# Altium schematic sheet FMC_Connector.SchDoc
size 594 x 419 mm; SheetNumber: 2; Title2: FMC Connector; ModifiedDate: -
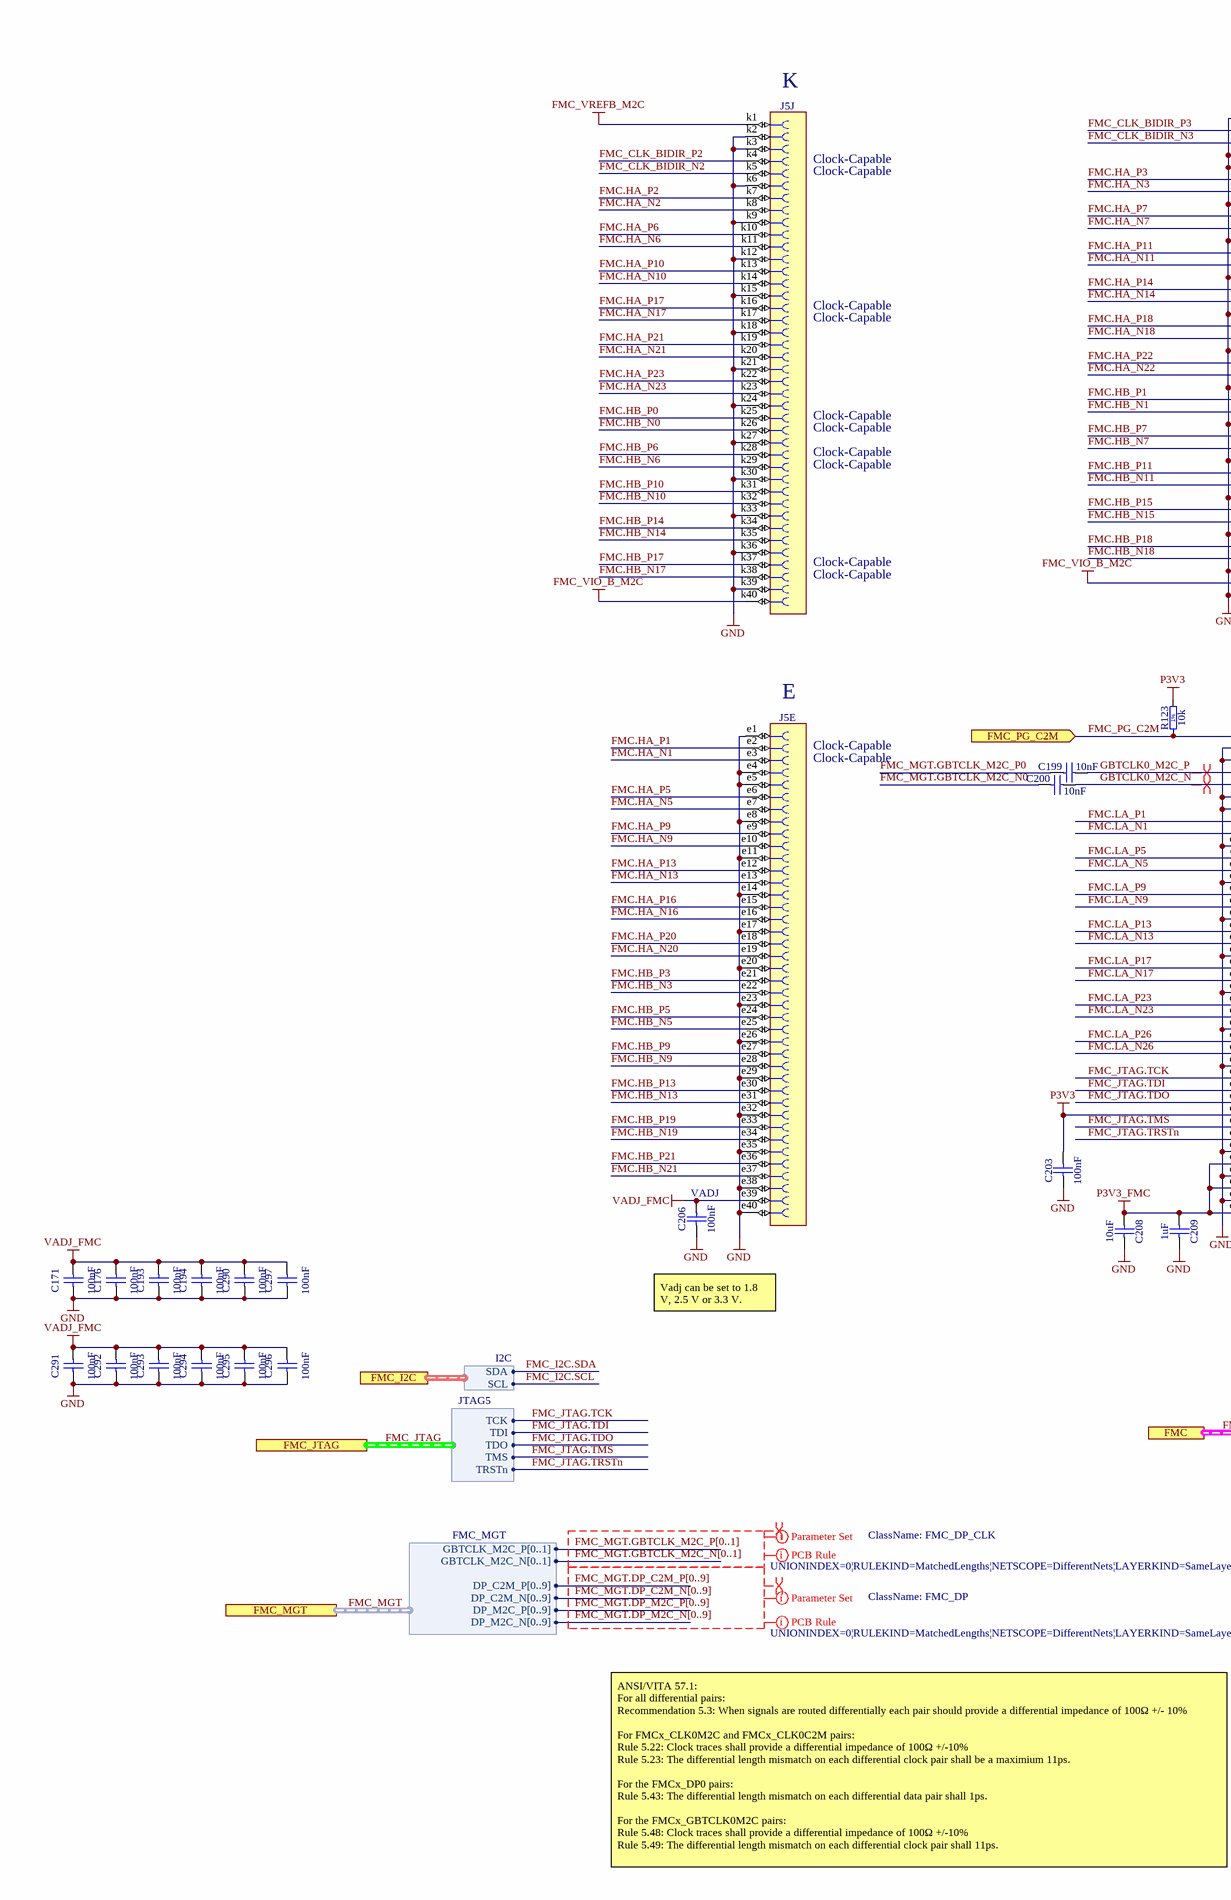
[diagram p0: FMC_Connector.SchDoc, left]
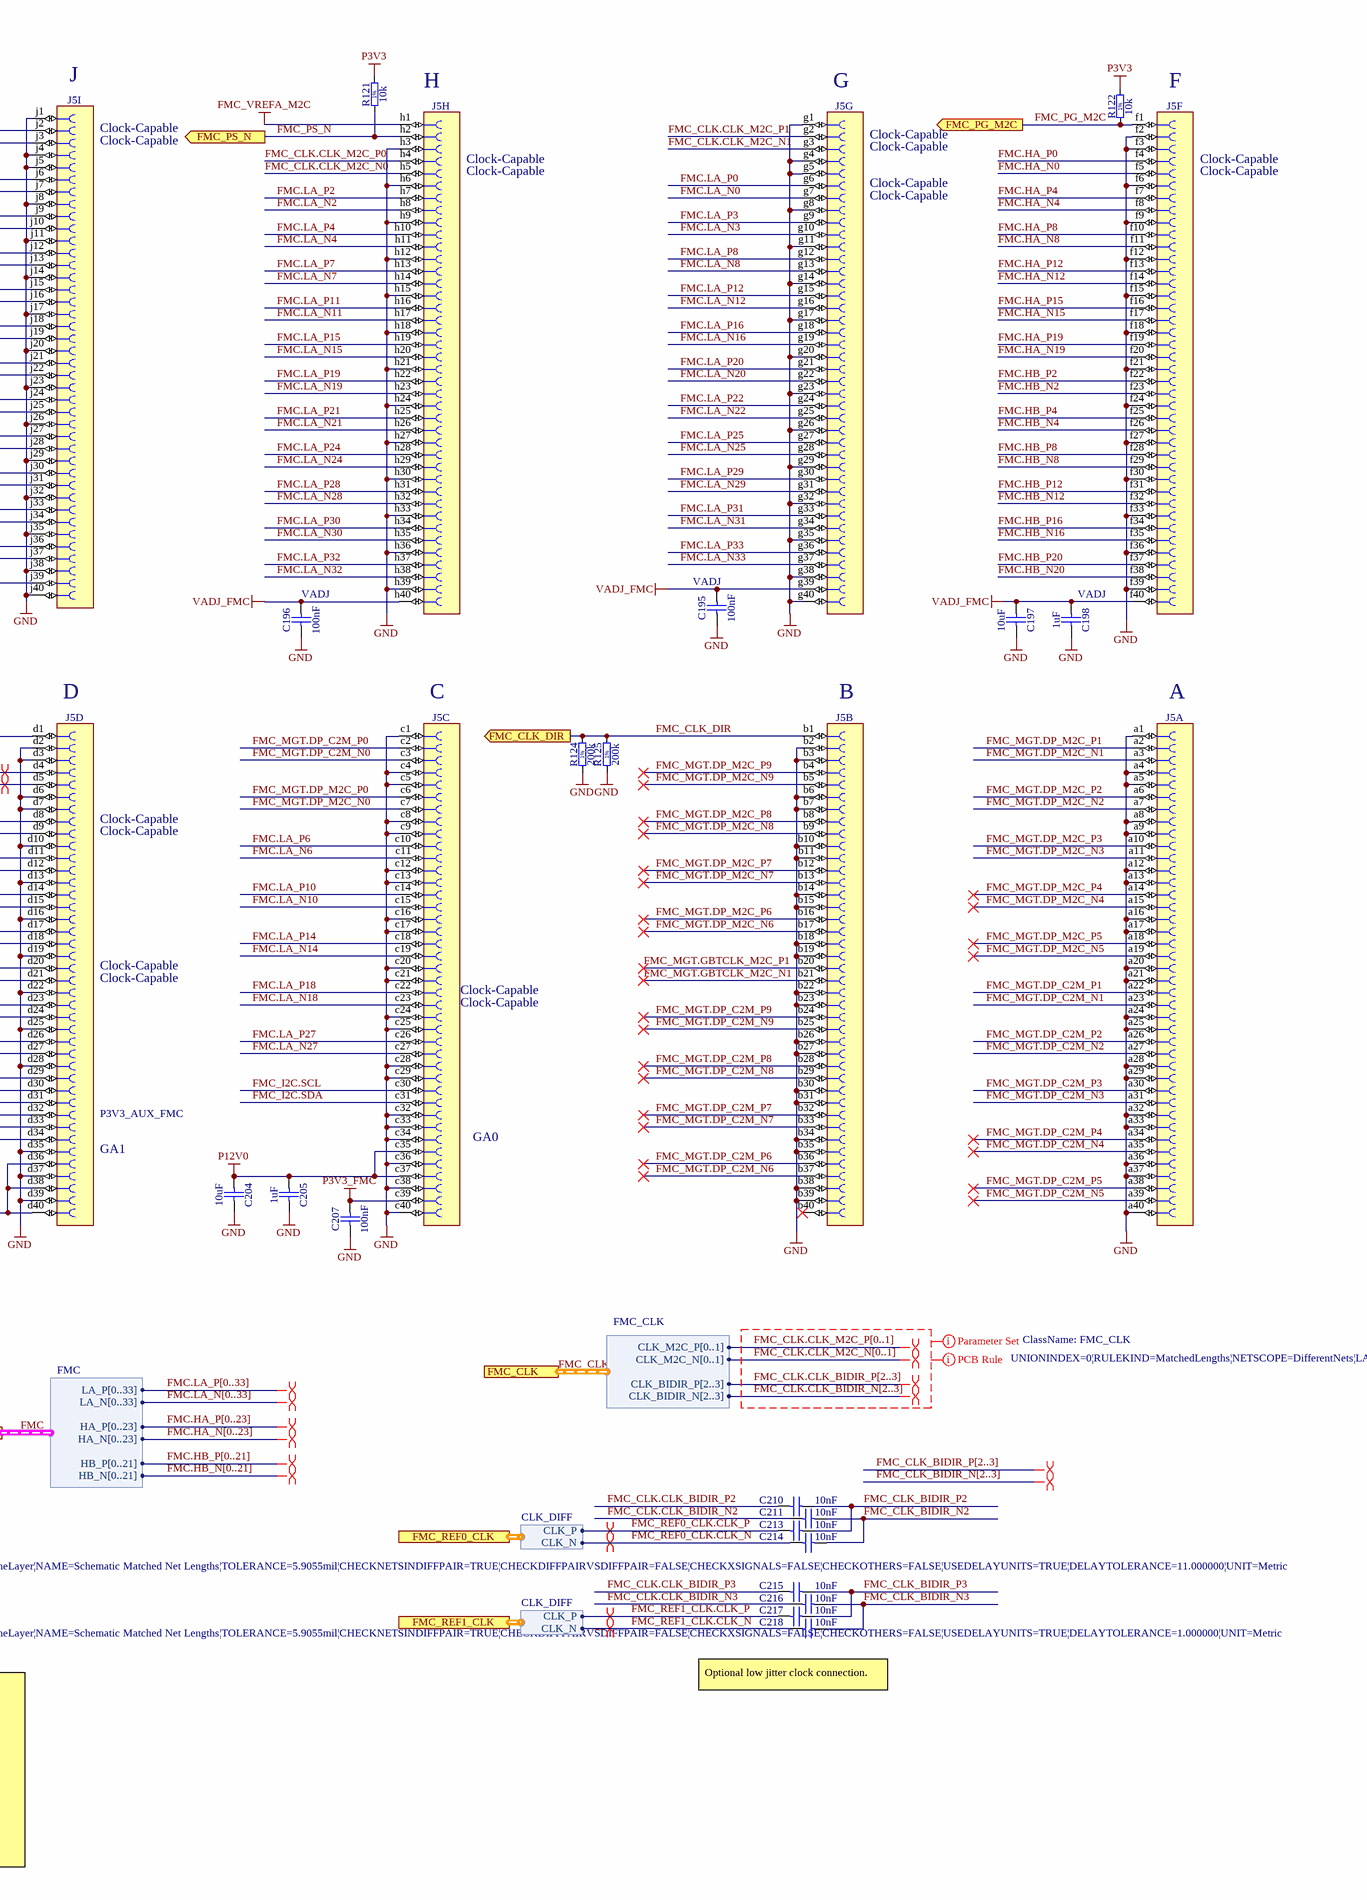
[diagram p1: FMC_Connector.SchDoc, right]

## Parts
C171  100nF  [CAPC0603X33N]
C176  100nF  [CAPC0603X33N]
C193  100nF  [CAPC0603X33N]
C194  100nF  [CAPC0603X33N]
C195  100nF  [CAPC1005X55N]
C196  100nF  [CAPC1005X55N]
C197  10uF  [CAPC2012X95N]
C198  1uF  [CAPC1005X55N]
C199  10nF  [CAPC1005X55N]
C200  10nF  [CAPC1005X55N]
C203  100nF  [CAPC1005X55N]
C204  10uF  [CAPC2012X95N]
C205  1uF  [CAPC1005X55N]
C206  100nF  [CAPC1005X55N]
C207  100nF  [CAPC1005X55N]
C208  10uF  [CAPC2012X95N]
C209  1uF  [CAPC1005X55N]
C210  10nF  [CAPC1005X55N]
C211  10nF  [CAPC1005X55N]
C213  10nF  [CAPC1005X55N]
C214  10nF  [CAPC1005X55N]
C215  10nF  [CAPC1005X55N]
C216  10nF  [CAPC1005X55N]
C217  10nF  [CAPC1005X55N]
C218  10nF  [CAPC1005X55N]
C290  100nF  [CAPC0603X33N]
C291  100nF  [CAPC0603X33N]
C292  100nF  [CAPC0603X33N]
C293  100nF  [CAPC0603X33N]
C294  100nF  [CAPC0603X33N]
C295  100nF  [CAPC0603X33N]
C296  100nF  [CAPC0603X33N]
C297  100nF  [CAPC0603X33N]
J5  VITA 57  [SAMTEC_ASP-134486-01]  (value not drawn)  (parts A,B,C,D,E,F,G,H,I,J of 10)
R121  10k  [RESC1005X40N]
R122  10k  [RESC1005X40N]
R123  10k  [RESC1005X40N]
R124  200k  [RESC1005X40N]
R125  200k  [RESC1005X40N]

## Ports
FMC (harness FMC), FMC_CLK (harness FMC_CLK), FMC_CLK_DIR (out), FMC_I2C (harness I2C), FMC_JTAG (harness JTAG5), FMC_MGT (harness FMC_MGT), FMC_PG_C2M (in), FMC_PG_M2C (out), FMC_PS_N (out), FMC_REF0_CLK (harness CLK_DIFF), FMC_REF1_CLK (harness CLK_DIFF)

## Harnesses
FMC: LA_P[0..33], LA_N[0..33], HA_P[0..23], HA_N[0..23], HB_P[0..21], HB_N[0..21]
JTAG5: TCK, TDI, TDO, TMS, TRSTn
FMC_MGT: GBTCLK_M2C_P[0..1], GBTCLK_M2C_N[0..1], DP_C2M_P[0..9], DP_C2M_N[0..9], DP_M2C_N[0..9], DP_M2C_P[0..9]
I2C: SDA, SCL
FMC_CLK: CLK_M2C_P[0..1], CLK_M2C_N[0..1], CLK_BIDIR_P[2..3], CLK_BIDIR_N[2..3]
CLK_DIFF: CLK_P, CLK_N

## Nets
FMC_VIO_B_M2C: J5.j39 J5.k40
FMC_VREFA_M2C: J5.h1
FMC_VREFB_M2C: J5.k1
GND: C171.1 C176.1 C193.1 C194.1 C195.1 C196.1 C197.2 C198.2 C203.1 C204.2 C205.2 C206.1 C207.1 C208.2 C209.2 C290.1 C291.1 C292.1 C293.1 C294.1 C295.1 C296.1 C297.1 J5.a1 J5.a4 J5.a5 J5.a8 J5.a9 J5.a12 J5.a13 J5.a16 J5.a17 J5.a20 J5.a21 J5.a24 J5.a25 J5.a28 J5.a29 J5.a32 J5.a33 J5.a36 J5.a37 J5.a40 J5.b2 J5.b3 J5.b6 J5.b7 J5.b10 J5.b11 J5.b14 J5.b15 J5.b18 J5.b19 J5.b22 J5.b23 J5.b26 J5.b27 J5.b30 J5.b31 J5.b34 J5.b35 J5.b38 J5.b39 J5.c1 J5.c4 J5.c5 J5.c8 J5.c9 J5.c12 J5.c13 J5.c16 J5.c17 J5.c20 J5.c21 J5.c24 J5.c25 J5.c28 J5.c29 J5.c32 J5.c33 J5.c34 J5.c36 J5.c38 J5.c40 J5.d2 J5.d3 J5.d6 J5.d7 J5.d10 J5.d13 J5.d16 J5.d19 J5.d22 J5.d25 J5.d28 J5.d35 J5.d37 J5.d39 J5.e1 J5.e4 J5.e5 J5.e8 J5.e11 J5.e14 J5.e17 J5.e20 J5.e23 J5.e26 J5.e29 J5.e32 J5.e35 J5.e38 J5.e40 J5.f2 J5.f3 J5.f6 J5.f9 J5.f12 J5.f15 J5.f18 J5.f21 J5.f24 J5.f27 J5.f30 J5.f33 J5.f36 J5.f39 J5.g1 J5.g4 J5.g5 J5.g8 J5.g11 J5.g14 J5.g17 J5.g20 J5.g23 J5.g26 J5.g29 J5.g32 J5.g35 J5.g38 J5.g40 J5.h3 J5.h6 J5.h9 J5.h12 J5.h15 J5.h18 J5.h21 J5.h24 J5.h27 J5.h30 J5.h33 J5.h36 J5.h39 J5.j1 J5.j4 J5.j5 J5.j8 J5.j11 J5.j14 J5.j17 J5.j20 J5.j23 J5.j26 J5.j29 J5.j32 J5.j35 J5.j38 J5.j40 J5.k2 J5.k3 J5.k6 J5.k9 J5.k12 J5.k15 J5.k18 J5.k21 J5.k24 J5.k27 J5.k30 J5.k33 J5.k36 J5.k39 R124.1 R125.1
P3V3: C203.2 J5.d32 R121.2 R122.2 R123.2
P3V3_FMC: C207.2 C208.1 C209.1 J5.c39 J5.d36 J5.d38 J5.d40
P12V0: C204.1 C205.1 J5.c35 J5.c37
VADJ_FMC: C171.2 C176.2 C193.2 C194.2 C195.2 C196.2 C197.1 C198.1 C206.2 C290.2 C291.2 C292.2 C293.2 C294.2 C295.2 C296.2 C297.2 J5.e39 J5.f40 J5.g39 J5.h40
FMC.HA_N0: J5.f5
FMC.HA_N1: J5.e3
FMC.HA_N2: J5.k8
FMC.HA_N3: J5.j7
FMC.HA_N4: J5.f8
FMC.HA_N5: J5.e7
FMC.HA_N6: J5.k11
FMC.HA_N7: J5.j10
FMC.HA_N8: J5.f11
FMC.HA_N9: J5.e10
FMC.HA_N10: J5.k14
FMC.HA_N11: J5.j13
FMC.HA_N12: J5.f14
FMC.HA_N13: J5.e13
FMC.HA_N14: J5.j16
FMC.HA_N15: J5.f17
FMC.HA_N16: J5.e16
FMC.HA_N17: J5.k17
FMC.HA_N18: J5.j19
FMC.HA_N19: J5.f20
FMC.HA_N20: J5.e19
FMC.HA_N21: J5.k20
FMC.HA_N22: J5.j22
FMC.HA_N23: J5.k23
FMC.HA_P0: J5.f4
FMC.HA_P1: J5.e2
FMC.HA_P2: J5.k7
FMC.HA_P3: J5.j6
FMC.HA_P4: J5.f7
FMC.HA_P5: J5.e6
FMC.HA_P6: J5.k10
FMC.HA_P7: J5.j9
FMC.HA_P8: J5.f10
FMC.HA_P9: J5.e9
FMC.HA_P10: J5.k13
FMC.HA_P11: J5.j12
FMC.HA_P12: J5.f13
FMC.HA_P13: J5.e12
FMC.HA_P14: J5.j15
FMC.HA_P15: J5.f16
FMC.HA_P16: J5.e15
FMC.HA_P17: J5.k16
FMC.HA_P18: J5.j18
FMC.HA_P19: J5.f19
FMC.HA_P20: J5.e18
FMC.HA_P21: J5.k19
FMC.HA_P22: J5.j21
FMC.HA_P23: J5.k22
FMC.HB_N0: J5.k26
FMC.HB_N1: J5.j25
FMC.HB_N2: J5.f23
FMC.HB_N3: J5.e22
FMC.HB_N4: J5.f26
FMC.HB_N5: J5.e25
FMC.HB_N6: J5.k29
FMC.HB_N7: J5.j28
FMC.HB_N8: J5.f29
FMC.HB_N9: J5.e28
FMC.HB_N10: J5.k32
FMC.HB_N11: J5.j31
FMC.HB_N12: J5.f32
FMC.HB_N13: J5.e31
FMC.HB_N14: J5.k35
FMC.HB_N15: J5.j34
FMC.HB_N16: J5.f35
FMC.HB_N17: J5.k38
FMC.HB_N18: J5.j37
FMC.HB_N19: J5.e34
FMC.HB_N20: J5.f38
FMC.HB_N21: J5.e37
FMC.HB_P0: J5.k25
FMC.HB_P1: J5.j24
FMC.HB_P2: J5.f22
FMC.HB_P3: J5.e21
FMC.HB_P4: J5.f25
FMC.HB_P5: J5.e24
FMC.HB_P6: J5.k28
FMC.HB_P7: J5.j27
FMC.HB_P8: J5.f28
FMC.HB_P9: J5.e27
FMC.HB_P10: J5.k31
FMC.HB_P11: J5.j30
FMC.HB_P12: J5.f31
FMC.HB_P13: J5.e30
FMC.HB_P14: J5.k34
FMC.HB_P15: J5.j33
FMC.HB_P16: J5.f34
FMC.HB_P17: J5.k37
FMC.HB_P18: J5.j36
FMC.HB_P19: J5.e33
FMC.HB_P20: J5.f37
FMC.HB_P21: J5.e36
FMC.LA_N0: J5.g7
FMC.LA_N1: J5.d9
FMC.LA_N2: J5.h8
FMC.LA_N3: J5.g10
FMC.LA_N4: J5.h11
FMC.LA_N5: J5.d12
FMC.LA_N6: J5.c11
FMC.LA_N7: J5.h14
FMC.LA_N8: J5.g13
FMC.LA_N9: J5.d15
FMC.LA_N10: J5.c15
FMC.LA_N11: J5.h17
FMC.LA_N12: J5.g16
FMC.LA_N13: J5.d18
FMC.LA_N14: J5.c19
FMC.LA_N15: J5.h20
FMC.LA_N16: J5.g19
FMC.LA_N17: J5.d21
FMC.LA_N18: J5.c23
FMC.LA_N19: J5.h23
FMC.LA_N20: J5.g22
FMC.LA_N21: J5.h26
FMC.LA_N22: J5.g25
FMC.LA_N23: J5.d24
FMC.LA_N24: J5.h29
FMC.LA_N25: J5.g28
FMC.LA_N26: J5.d27
FMC.LA_N27: J5.c27
FMC.LA_N28: J5.h32
FMC.LA_N29: J5.g31
FMC.LA_N30: J5.h35
FMC.LA_N31: J5.g34
FMC.LA_N32: J5.h38
FMC.LA_N33: J5.g37
FMC.LA_P0: J5.g6
FMC.LA_P1: J5.d8
FMC.LA_P2: J5.h7
FMC.LA_P3: J5.g9
FMC.LA_P4: J5.h10
FMC.LA_P5: J5.d11
FMC.LA_P6: J5.c10
FMC.LA_P7: J5.h13
FMC.LA_P8: J5.g12
FMC.LA_P9: J5.d14
FMC.LA_P10: J5.c14
FMC.LA_P11: J5.h16
FMC.LA_P12: J5.g15
FMC.LA_P13: J5.d17
FMC.LA_P14: J5.c18
FMC.LA_P15: J5.h19
FMC.LA_P16: J5.g18
FMC.LA_P17: J5.d20
FMC.LA_P18: J5.c22
FMC.LA_P19: J5.h22
FMC.LA_P20: J5.g21
FMC.LA_P21: J5.h25
FMC.LA_P22: J5.g24
FMC.LA_P23: J5.d23
FMC.LA_P24: J5.h28
FMC.LA_P25: J5.g27
FMC.LA_P26: J5.d26
FMC.LA_P27: J5.c26
FMC.LA_P28: J5.h31
FMC.LA_P29: J5.g30
FMC.LA_P30: J5.h34
FMC.LA_P31: J5.g33
FMC.LA_P32: J5.h37
FMC.LA_P33: J5.g36
FMC_CLK.CLK_BIDIR_N2: C211.2
FMC_CLK.CLK_BIDIR_N3: C216.2
FMC_CLK.CLK_BIDIR_P2: C210.2
FMC_CLK.CLK_BIDIR_P3: C215.2
FMC_CLK.CLK_M2C_N0: J5.h5
FMC_CLK.CLK_M2C_N1: J5.g3
FMC_CLK.CLK_M2C_P0: J5.h4
FMC_CLK.CLK_M2C_P1: J5.g2
FMC_CLK_BIDIR_N2: C211.1 C214.1 J5.k5
FMC_CLK_BIDIR_N3: C216.1 C218.1 J5.j3
FMC_CLK_BIDIR_P2: C210.1 C213.1 J5.k4
FMC_CLK_BIDIR_P3: C215.1 C217.1 J5.j2
FMC_CLK_DIR: J5.b1 R124.2 R125.2 ; port FMC_CLK_DIR
FMC_I2C.SCL: J5.c30 ; port FMC_I2C.SCL
FMC_I2C.SDA: J5.c31 ; port FMC_I2C.SDA
FMC_JTAG.TCK: J5.d29 ; port FMC_JTAG.TCK
FMC_JTAG.TDI: J5.d30 ; port FMC_JTAG.TDI
FMC_JTAG.TDO: J5.d31 ; port FMC_JTAG.TDO
FMC_JTAG.TMS: J5.d33 ; port FMC_JTAG.TMS
FMC_JTAG.TRSTn: J5.d34 ; port FMC_JTAG.TRSTn
FMC_MGT.DP_C2M_N0: J5.c3
FMC_MGT.DP_C2M_N1: J5.a23
FMC_MGT.DP_C2M_N2: J5.a27
FMC_MGT.DP_C2M_N3: J5.a31
FMC_MGT.DP_C2M_N4: J5.a35
FMC_MGT.DP_C2M_N5: J5.a39
FMC_MGT.DP_C2M_N6: J5.b37
FMC_MGT.DP_C2M_N7: J5.b33
FMC_MGT.DP_C2M_N8: J5.b29
FMC_MGT.DP_C2M_N9: J5.b25
FMC_MGT.DP_C2M_P0: J5.c2
FMC_MGT.DP_C2M_P1: J5.a22
FMC_MGT.DP_C2M_P2: J5.a26
FMC_MGT.DP_C2M_P3: J5.a30
FMC_MGT.DP_C2M_P4: J5.a34
FMC_MGT.DP_C2M_P5: J5.a38
FMC_MGT.DP_C2M_P6: J5.b36
FMC_MGT.DP_C2M_P7: J5.b32
FMC_MGT.DP_C2M_P8: J5.b28
FMC_MGT.DP_C2M_P9: J5.b24
FMC_MGT.DP_M2C_N0: J5.c7
FMC_MGT.DP_M2C_N1: J5.a3
FMC_MGT.DP_M2C_N2: J5.a7
FMC_MGT.DP_M2C_N3: J5.a11
FMC_MGT.DP_M2C_N4: J5.a15
FMC_MGT.DP_M2C_N5: J5.a19
FMC_MGT.DP_M2C_N6: J5.b17
FMC_MGT.DP_M2C_N7: J5.b13
FMC_MGT.DP_M2C_N8: J5.b9
FMC_MGT.DP_M2C_N9: J5.b5
FMC_MGT.DP_M2C_P0: J5.c6
FMC_MGT.DP_M2C_P1: J5.a2
FMC_MGT.DP_M2C_P2: J5.a6
FMC_MGT.DP_M2C_P3: J5.a10
FMC_MGT.DP_M2C_P4: J5.a14
FMC_MGT.DP_M2C_P5: J5.a18
FMC_MGT.DP_M2C_P6: J5.b16
FMC_MGT.DP_M2C_P7: J5.b12
FMC_MGT.DP_M2C_P8: J5.b8
FMC_MGT.DP_M2C_P9: J5.b4
FMC_MGT.GBTCLK_M2C_N0: C200.2
FMC_MGT.GBTCLK_M2C_N1: J5.b21
FMC_MGT.GBTCLK_M2C_P0: C199.2
FMC_MGT.GBTCLK_M2C_P1: J5.b20
FMC_PG_C2M: J5.d1 R123.1 ; port FMC_PG_C2M
FMC_PG_M2C: J5.f1 R122.1 ; port FMC_PG_M2C
FMC_PS_N: J5.h2 R121.1 ; port FMC_PS_N
FMC_REF0_CLK.CLK_N: C214.2 ; port FMC_REF0_CLK.CLK_N
FMC_REF0_CLK.CLK_P: C213.2 ; port FMC_REF0_CLK.CLK_P
FMC_REF1_CLK.CLK_N: C218.2 ; port FMC_REF1_CLK.CLK_N
FMC_REF1_CLK.CLK_P: C217.2 ; port FMC_REF1_CLK.CLK_P
GBTCLK0_M2C_N: C200.1 J5.d5
GBTCLK0_M2C_P: C199.1 J5.d4

Not connected (* = marked no-connect by the designer): J5 b40*

## Buses and harness runs
bus FMC.HA_N[0..23]
bus FMC.HA_P[0..23]
bus FMC.HB_N[0..21]
bus FMC.HB_P[0..21]
bus FMC.LA_N[0..33]
bus FMC.LA_P[0..33]
bus FMC_CLK.CLK_BIDIR_N[2..3]
bus FMC_CLK.CLK_BIDIR_P[2..3]
bus FMC_CLK.CLK_M2C_N[0..1]
bus FMC_CLK.CLK_M2C_P[0..1]
bus FMC_CLK_BIDIR_N[2..3]
bus FMC_CLK_BIDIR_P[2..3]
bus FMC_MGT.DP_C2M_N[0..9]
bus FMC_MGT.DP_C2M_P[0..9]
bus FMC_MGT.DP_M2C_N[0..9]
bus FMC_MGT.DP_M2C_P[0..9]
bus FMC_MGT.GBTCLK_M2C_N[0..1]
bus FMC_MGT.GBTCLK_M2C_P[0..1]
harness FMC = port FMC
harness FMC_CLK = port FMC_CLK
harness FMC_JTAG = port FMC_JTAG
harness FMC_MGT = port FMC_MGT

## Layout directives
net class FMC_CLK: FMC_CLK.CLK_BIDIR_N[2..3], FMC_CLK.CLK_BIDIR_P[2..3], FMC_CLK.CLK_M2C_N[0..1], FMC_CLK.CLK_M2C_P[0..1]
rule Matched Net Lengths [Delay Tolerance = 11ps]: FMC_CLK.CLK_BIDIR_N[2..3], FMC_CLK.CLK_BIDIR_P[2..3], FMC_CLK.CLK_M2C_N[0..1], FMC_CLK.CLK_M2C_P[0..1], FMC_MGT.GBTCLK_M2C_N[0..1], FMC_MGT.GBTCLK_M2C_P[0..1]
differential pair: FMC_MGT.DP_C2M_N[0..9], FMC_MGT.DP_C2M_P[0..9], FMC_MGT.DP_M2C_N[0..9], FMC_MGT.DP_M2C_P[0..9], FMC_MGT.GBTCLK_M2C_N[0..1], FMC_MGT.GBTCLK_M2C_P[0..1], FMC_REF0_CLK.CLK_N, FMC_REF0_CLK.CLK_P, FMC_REF1_CLK.CLK_N, FMC_REF1_CLK.CLK_P
net class FMC_DP: FMC_MGT.DP_C2M_N[0..9], FMC_MGT.DP_C2M_P[0..9], FMC_MGT.DP_M2C_N[0..9], FMC_MGT.DP_M2C_P[0..9]
rule Matched Net Lengths [Delay Tolerance = 1ps]: FMC_MGT.DP_C2M_N[0..9], FMC_MGT.DP_C2M_P[0..9], FMC_MGT.DP_M2C_N[0..9], FMC_MGT.DP_M2C_P[0..9]
differential pair; differential pair class FMC_LA: (no net found under the mark)
differential pair; differential pair class Diff_100Ohm: FMC_CLK.CLK_BIDIR_N[2..3], FMC_CLK.CLK_BIDIR_P[2..3], FMC_CLK.CLK_M2C_N[0..1], FMC_CLK.CLK_M2C_P[0..1], GBTCLK0_M2C_N, GBTCLK0_M2C_P
differential pair; differential pair class FMC_HA: (no net found under the mark)
differential pair; differential pair class FMC_HB: (no net found under the mark)
differential pair; differential pair class LVPECL: (no net found under the mark)
net class FMC_DP_CLK: FMC_MGT.GBTCLK_M2C_N[0..1], FMC_MGT.GBTCLK_M2C_P[0..1]

## Notes on the sheet
- (near J5) K
- (near J5) J
- (near J5) Clock-Capable
- H
- (near J5) G
- F
- (near C196) VADJ
- (near C195) VADJ
- (near C198) VADJ
- (near J5) E
- (near J5) D
- (near J5) C
- (near J5) B
- (near J5) A
- (near J5) P3V3_AUX_FMC
- (near J5) GA1
- GA0
- (near C206) VADJ
- Vadj can be set to 1.8 V, 2.5 V or 3.3 V.
- Optional low jitter clock connection.
- ANSI/VITA 57.1:
  For all differential pairs:
  Recommendation 5.3: When signals are routed differentially each pair should provide a differential impedance of 100Ω +/- 10%
  For FMCx_CLK0M2C and FMCx_CLK0C2M pairs:
  Rule 5.22: Clock traces shall provide a differential impedance of 100Ω +/-10%
  Rule 5.23: The differential length mismatch on each differential clock pair shall be a maximium 11ps.
  For the FMCx_DP0 pairs:
  Rule 5.43: The differential length mismatch on each differential data pair shall 1ps.
  For the FMCx_GBTCLK0M2C pairs:
  Rule 5.48: Clock traces shall provide a differential impedance of 100Ω +/-10%
  Rule 5.49: The differential length mismatch on each differential clock pair shall 11ps.
- Project/Equipment
- Document
- Designer
- Drawn by
- Contact:
- File
- Check.by
- Last Mod.
- Print Date
- Sheet
- Size
- A3
- of
- Rev
- Copyright WUT =CopyrightYear .
  This document describes Open Hardware and is licensed under the CERN-OHL-W v2
  You may redistribute and modify this documentation and make products using it under the terms of the CERN-OHL-W v2 (https:/cern.ch/cern-ohl). This documentation is distributed WITHOUT ANY EXPRESS OR IMPLIED WARRANTY, INCLUDING OF MERCHANTABILITY, SATISFACTORY QUALITY AND FITNESS FOR A PARTICULAR PURPOSE. Please see the CERN-OHL-W v2 for applicable conditions.
  Source location: https://github.com/sinara-hw/EEM_FMC_Carrier
  As per CERN-OHL-W v2 section 4, should You produce hardware based on these sources, You must maintain the Source Location visible on the silkscreen or top copper for a EEM FMC Carrier PCB or other product you make using this documentation.
- (in symbol R0402_10K_1%_0.0625W_100PPM) 1%
- (in symbol R0402_200K_1%_0.0625W_100PPM) 1%

## Library data of the parts
C171 C176 C193 C194 C290-C297 = CC0201_100NF_6.3V_10%_X5R: Non-polarised capacitor; Part Description: SMD Multilayer Chip Ceramic Capacitor; Manufacturer: GENERIC; Manufacturer1 Part Number: 02016D104KAT2A; Voltage: 6.3V; TC: X5R; Tolerance: ±10%; Part Number: CC0201_100NF_6.3V_10%_X5R; Component Kind: Standard; Component Type: Standard; Pin Count: 2; Value: 100nF; Status: Not Recommended; Manufacturer Part Number: CC0201_100NF_6.3V_10%_X5R; Case: 0201; Mounted: Yes; Socket: No; SMD: Yes; Manufacturer1 Example: AVX; Manufacturer1 ComponentHeight: 0.33mm; HelpURL: \\cern.ch\dfs\Applications\Altium\Datasheets\CC0201_X5R_AVX.pdf; Author: CERN DEM JLC; CreateDate: 2007-12-03; LatestRevisionDate: 2007-12-03; Sense: No
C195 C196 C203 C206 C207 = CC0402_100NF_25V_10%_X7R_YUDEN_TMK105B7104KVHF: Non-polarised capacitor; Part Description: SMD Multilayer Chip Ceramic Capacitor (High Dielectric Type) for Automotive / Industrial Applications; Manufacturer: TAIYO YUDEN; Voltage: 25V; TC: X7R; Tolerance: ±10%; Part Number: CC0402_100NF_25V_10%_X7R_YUDEN_TMK105B7104KVHF; Component Kind: Standard; Component Type: Standard; Pin Count: 2; Value: 100nF; Status: Not Recommended; Manufacturer Part Number: TMK105B7104KVHF; Case: 0402; Mounted: Yes; Socket: No; SMD: Yes; Sense: No; HelpURL: \\cern.ch\dfs\Applications\Altium\Datasheets\CC0402_TAIYO-YUDEN_TMK105B7104KVHF.pdf; Author: CERN DEM JLC; CreateDate: 10-May-17; LatestRevisionDate: 10-May-17; ComponentHeight: 0.55mm
C197 C204 C208 = CC0805_10UF_25V_10%_X5R: Non-polarised capacitor; Part Description: SMD Multilayer Chip Ceramic Capacitor; Manufacturer: GENERIC; Manufacturer1 Part Number: GRM219R61E106KA12D; Voltage: 25V; TC: X5R; Tolerance: ±10%; Part Number: CC0805_10UF_25V_10%_X5R; Component Kind: Standard; Component Type: Standard; Pin Count: 2; Value: 10uF; Status: Preferred; Manufacturer Part Number: CC0805_10UF_25V_10%_X5R; Case: 0805; Mounted: Yes; Socket: No; SMD: Yes; Sense: No; Manufacturer1 Example: MURATA; Manufacturer1 ComponentHeight: 0.95mm; HelpURL: \\cern.ch\dfs\Applications\Altium\Datasheets\CC0805_X5R_MURATA_GRM.pdf; Author: CERN DEM JLC; CreateDate: 25.10.2012; LatestRevisionDate: 06.09.2016
C198 C205 C209 = CC0402_1UF_16V_10%_X5R: Non-polarised capacitor; Part Description: SMD Multilayer Chip Ceramic Capacitor; Manufacturer: GENERIC; Manufacturer1 Part Number: C1005X5R1C105KT; Voltage: 16V; TC: X5R; Tolerance: ±10%; Part Number: CC0402_1UF_16V_10%_X5R; Component Kind: Standard; Component Type: Standard; Pin Count: 2; Value: 1uF; Status: Preferred; Manufacturer Part Number: CC0402_1UF_16V_10%_X5R; Case: 0402; Mounted: Yes; Socket: No; SMD: Yes; Sense: No; Manufacturer1 Example: TDK; Manufacturer1 ComponentHeight: 0.55mm; HelpURL: \\cern.ch\dfs\Applications\Altium\Datasheets\CC0402_X5R_TDK_C.pdf; Author: CERN DEM JLC; CreateDate: 25.10.2012; LatestRevisionDate: 25.10.2012
C199 C200 C210 C211 C213-C218 = CC0402_10NF_16V_10%_X7R: Non-polarised capacitor; Part Description: SMD Multilayer Chip Ceramic Capacitor; Manufacturer: GENERIC; Manufacturer1 Part Number: 223878715636; Voltage: 16V; TC: X7R; Tolerance: ±10%; Part Number: CC0402_10NF_16V_10%_X7R; Component Kind: Standard; Component Type: Standard; Pin Count: 2; Value: 10nF; Status: Not Recommended; Manufacturer Part Number: CC0402_10NF_16V_10%_X7R; Case: 0402; Mounted: Yes; Socket: No; SMD: Yes; Manufacturer1 Example: PHYCOMP; Manufacturer1 ComponentHeight: 0.55mm; HelpURL: \\cern.ch\dfs\Applications\Altium\Datasheets\CC0402_X7R_PHYCOMP.pdf; Author: CERN DEM JLC; CreateDate: 03-Dec-07; LatestRevisionDate: 03-Dec-07; Sense: No
J5 = SAMTEC_ASP-134486-01: Connector VITA 57, 400 Female contacts in 10 row abcdefghj; Part Description: 400 contacts (10 rows abcdefghj) Surface Mount Female Connector, VITA 57 (CC-HPC-10); Manufacturer: SAMTEC; PressFit: No; Part Number: SAMTEC_ASP-134486-01; Component Kind: Standard; Component Type: Standard; Pin Count: 400; Family: VITA 57; Mounted: Yes; Socket: No; SMD: Yes; Status: None; Manufacturer Part Number: ASP-134486-01; ComponentHeight: 6.55mm; HelpURL: \\cern.ch\dfs\Applications\Altium\Datasheets\SAMTEC_ASP-134486-01.pdf; Author: CERN DEM JLC; CreateDate: 30-Apr-09; LatestRevisionDate: 17-Aug-09; Sense: No
R121-R123 = R0402_10K_1%_0.0625W_100PPM: Resistor - 1%; Part Description: General Purpose Thick Film Chip Resistor; Manufacturer: GENERIC; Manufacturer1 Part Number: 232270671003L; TC: ±100ppm/°C; PressFit: No; Part Number: R0402_10K_1%_0.0625W_100PPM; Component Kind: Standard; Component Type: Standard; Pin Count: 2; Value: 10k; Status: Not Recommended; Power: 0.0625W; Tolerance: ±1%; Manufacturer Part Number: R0402_10K_1%_0.0625W_100PPM; Case: 0402; Mounted: Yes; Socket: No; SMD: Yes; Manufacturer1 Example: YAGEO PHYCOMP; Manufacturer1 ComponentHeight: 0.4mm; HelpURL: \\cern.ch\dfs\Applications\Altium\Datasheets\R0402_Phycomp_RC0402.pdf; Author: CERN DEM JLC; CreateDate: 03.12.2007; LatestRevisionDate: 17.10.2012; Sense: No
R124 R125 = R0402_200K_1%_0.0625W_100PPM: Resistor - 1%; Part Description: General Purpose Thick Film Chip Resistor; Manufacturer: GENERIC; Manufacturer1 Part Number: 232270672004L; TC: ±100ppm/°C; PressFit: No; Part Number: R0402_200K_1%_0.0625W_100PPM; Component Kind: Standard; Component Type: Standard; Pin Count: 2; Value: 200k; Status: Not Recommended; Power: 0.0625W; Tolerance: ±1%; Manufacturer Part Number: R0402_200K_1%_0.0625W_100PPM; Case: 0402; Mounted: Yes; Sense: No; Socket: No; SMD: Yes; Manufacturer1 Example: YAGEO PHYCOMP; Manufacturer1 ComponentHeight: 0.4mm; HelpURL: \\cern.ch\dfs\Applications\Altium\Datasheets\R0402_Phycomp_RC0402.pdf; Author: CERN DEM JLC; CreateDate: 2007-12-03; LatestRevisionDate: 2012-10-17